# EAGLE design PT_2015_DB_MAIN_Rev1 (EAGLE 7.1.0)
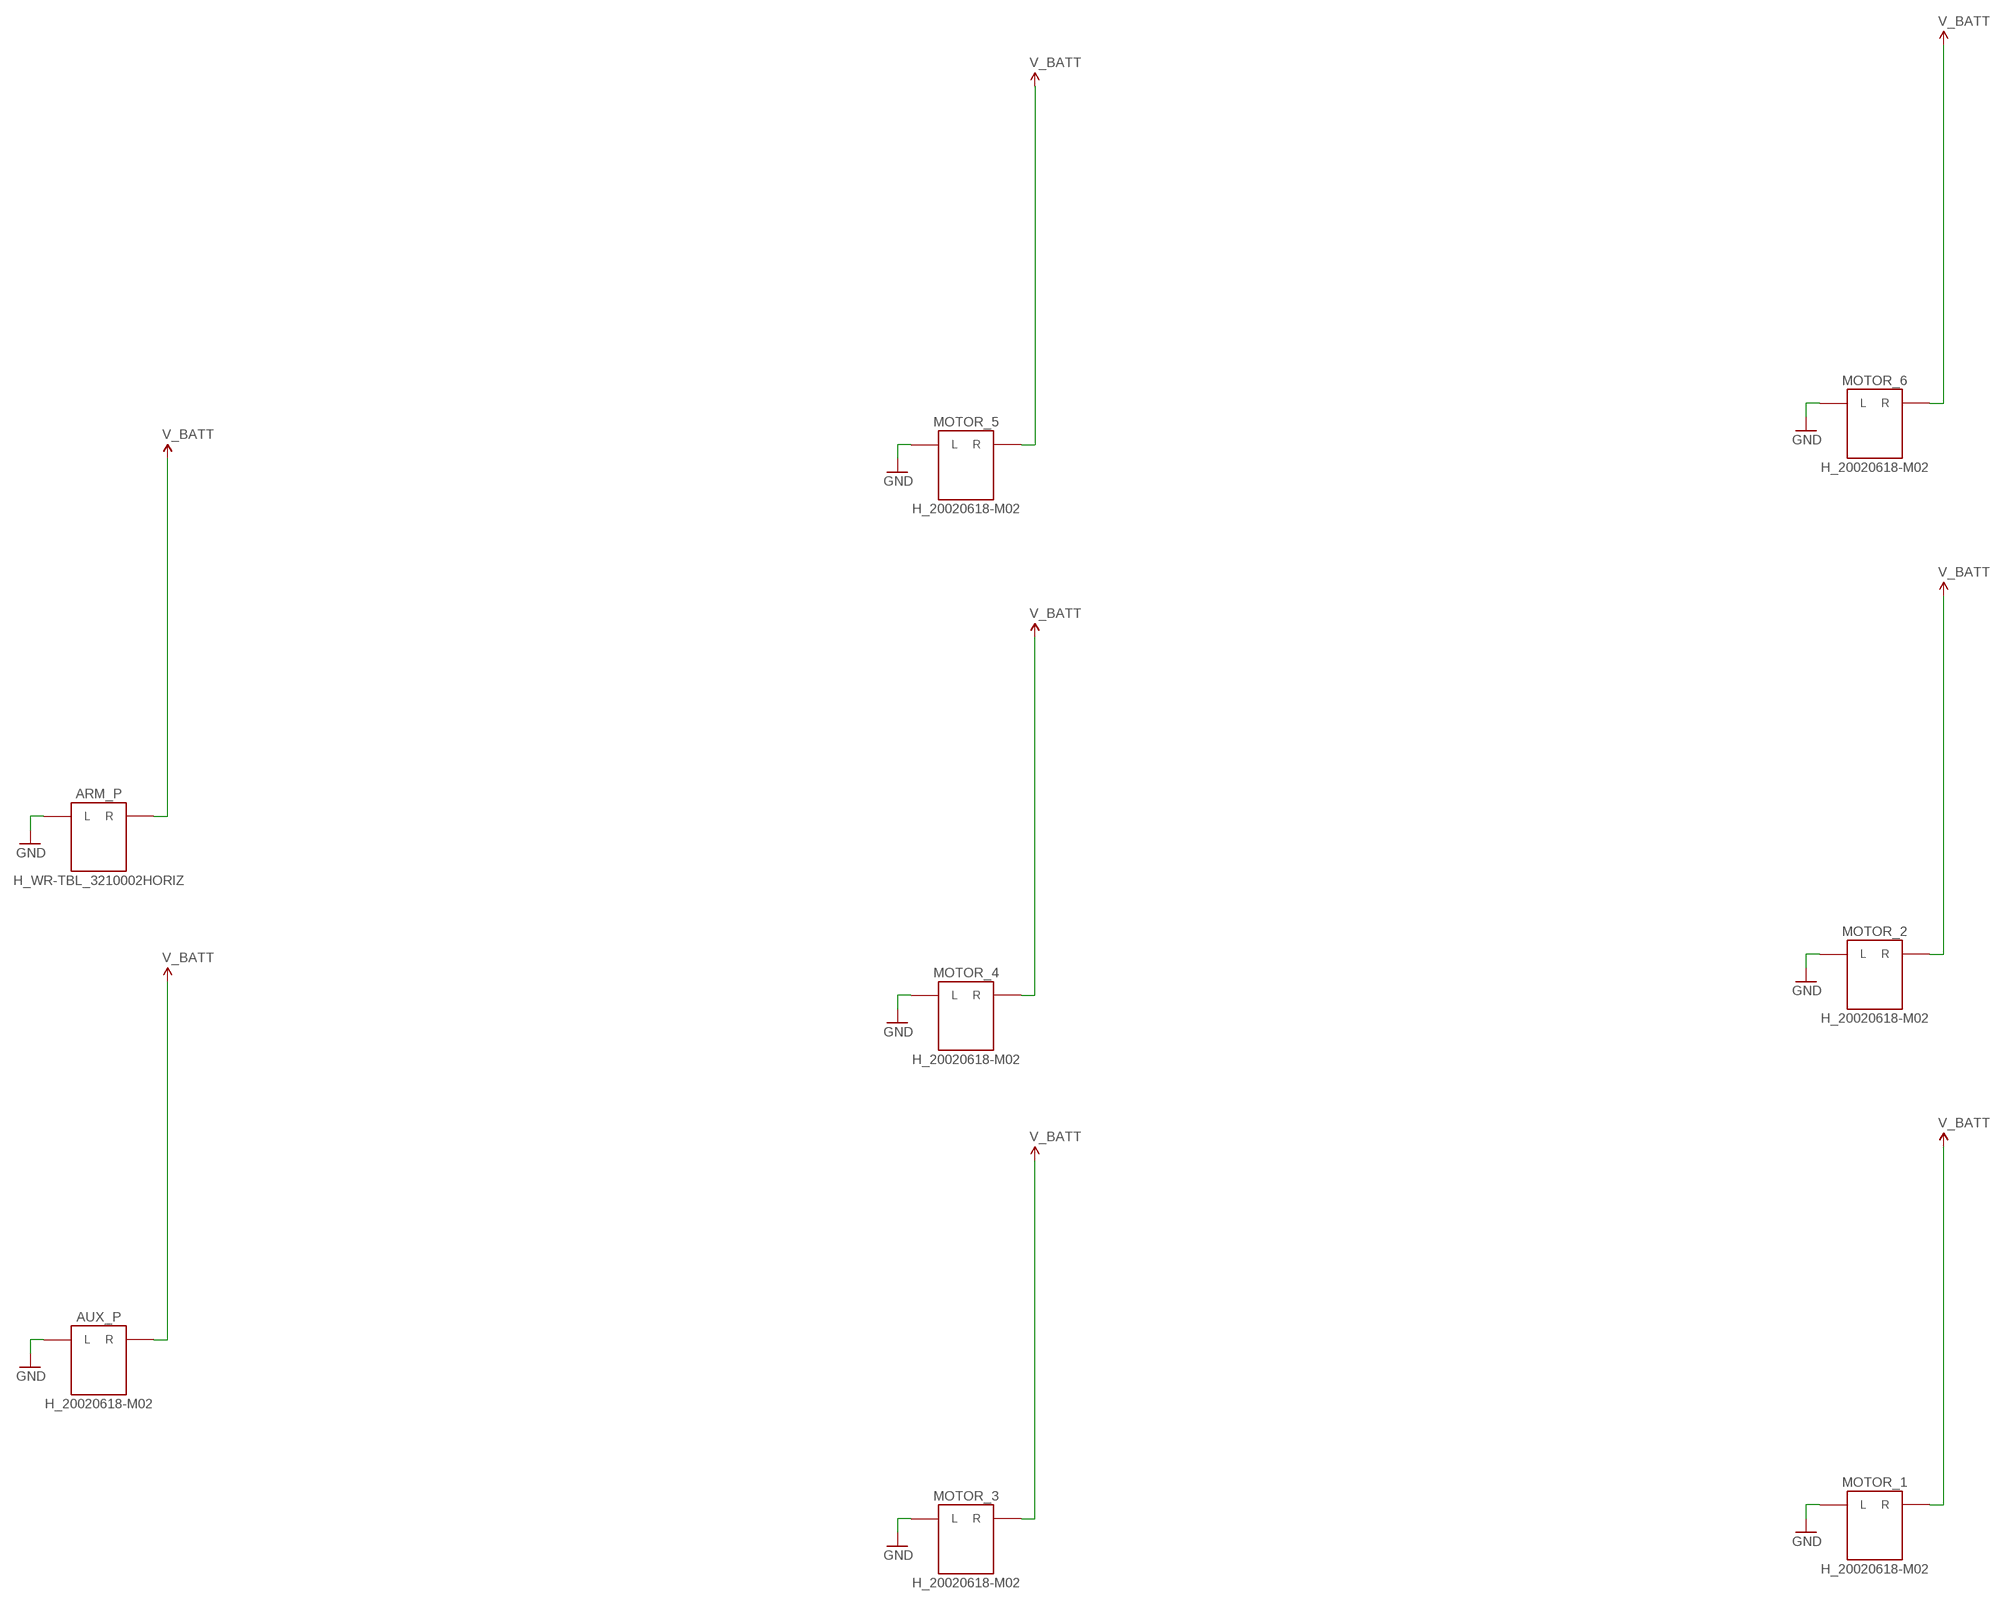
[diagram p0: schematic, sheet 1, part 1 of 2]
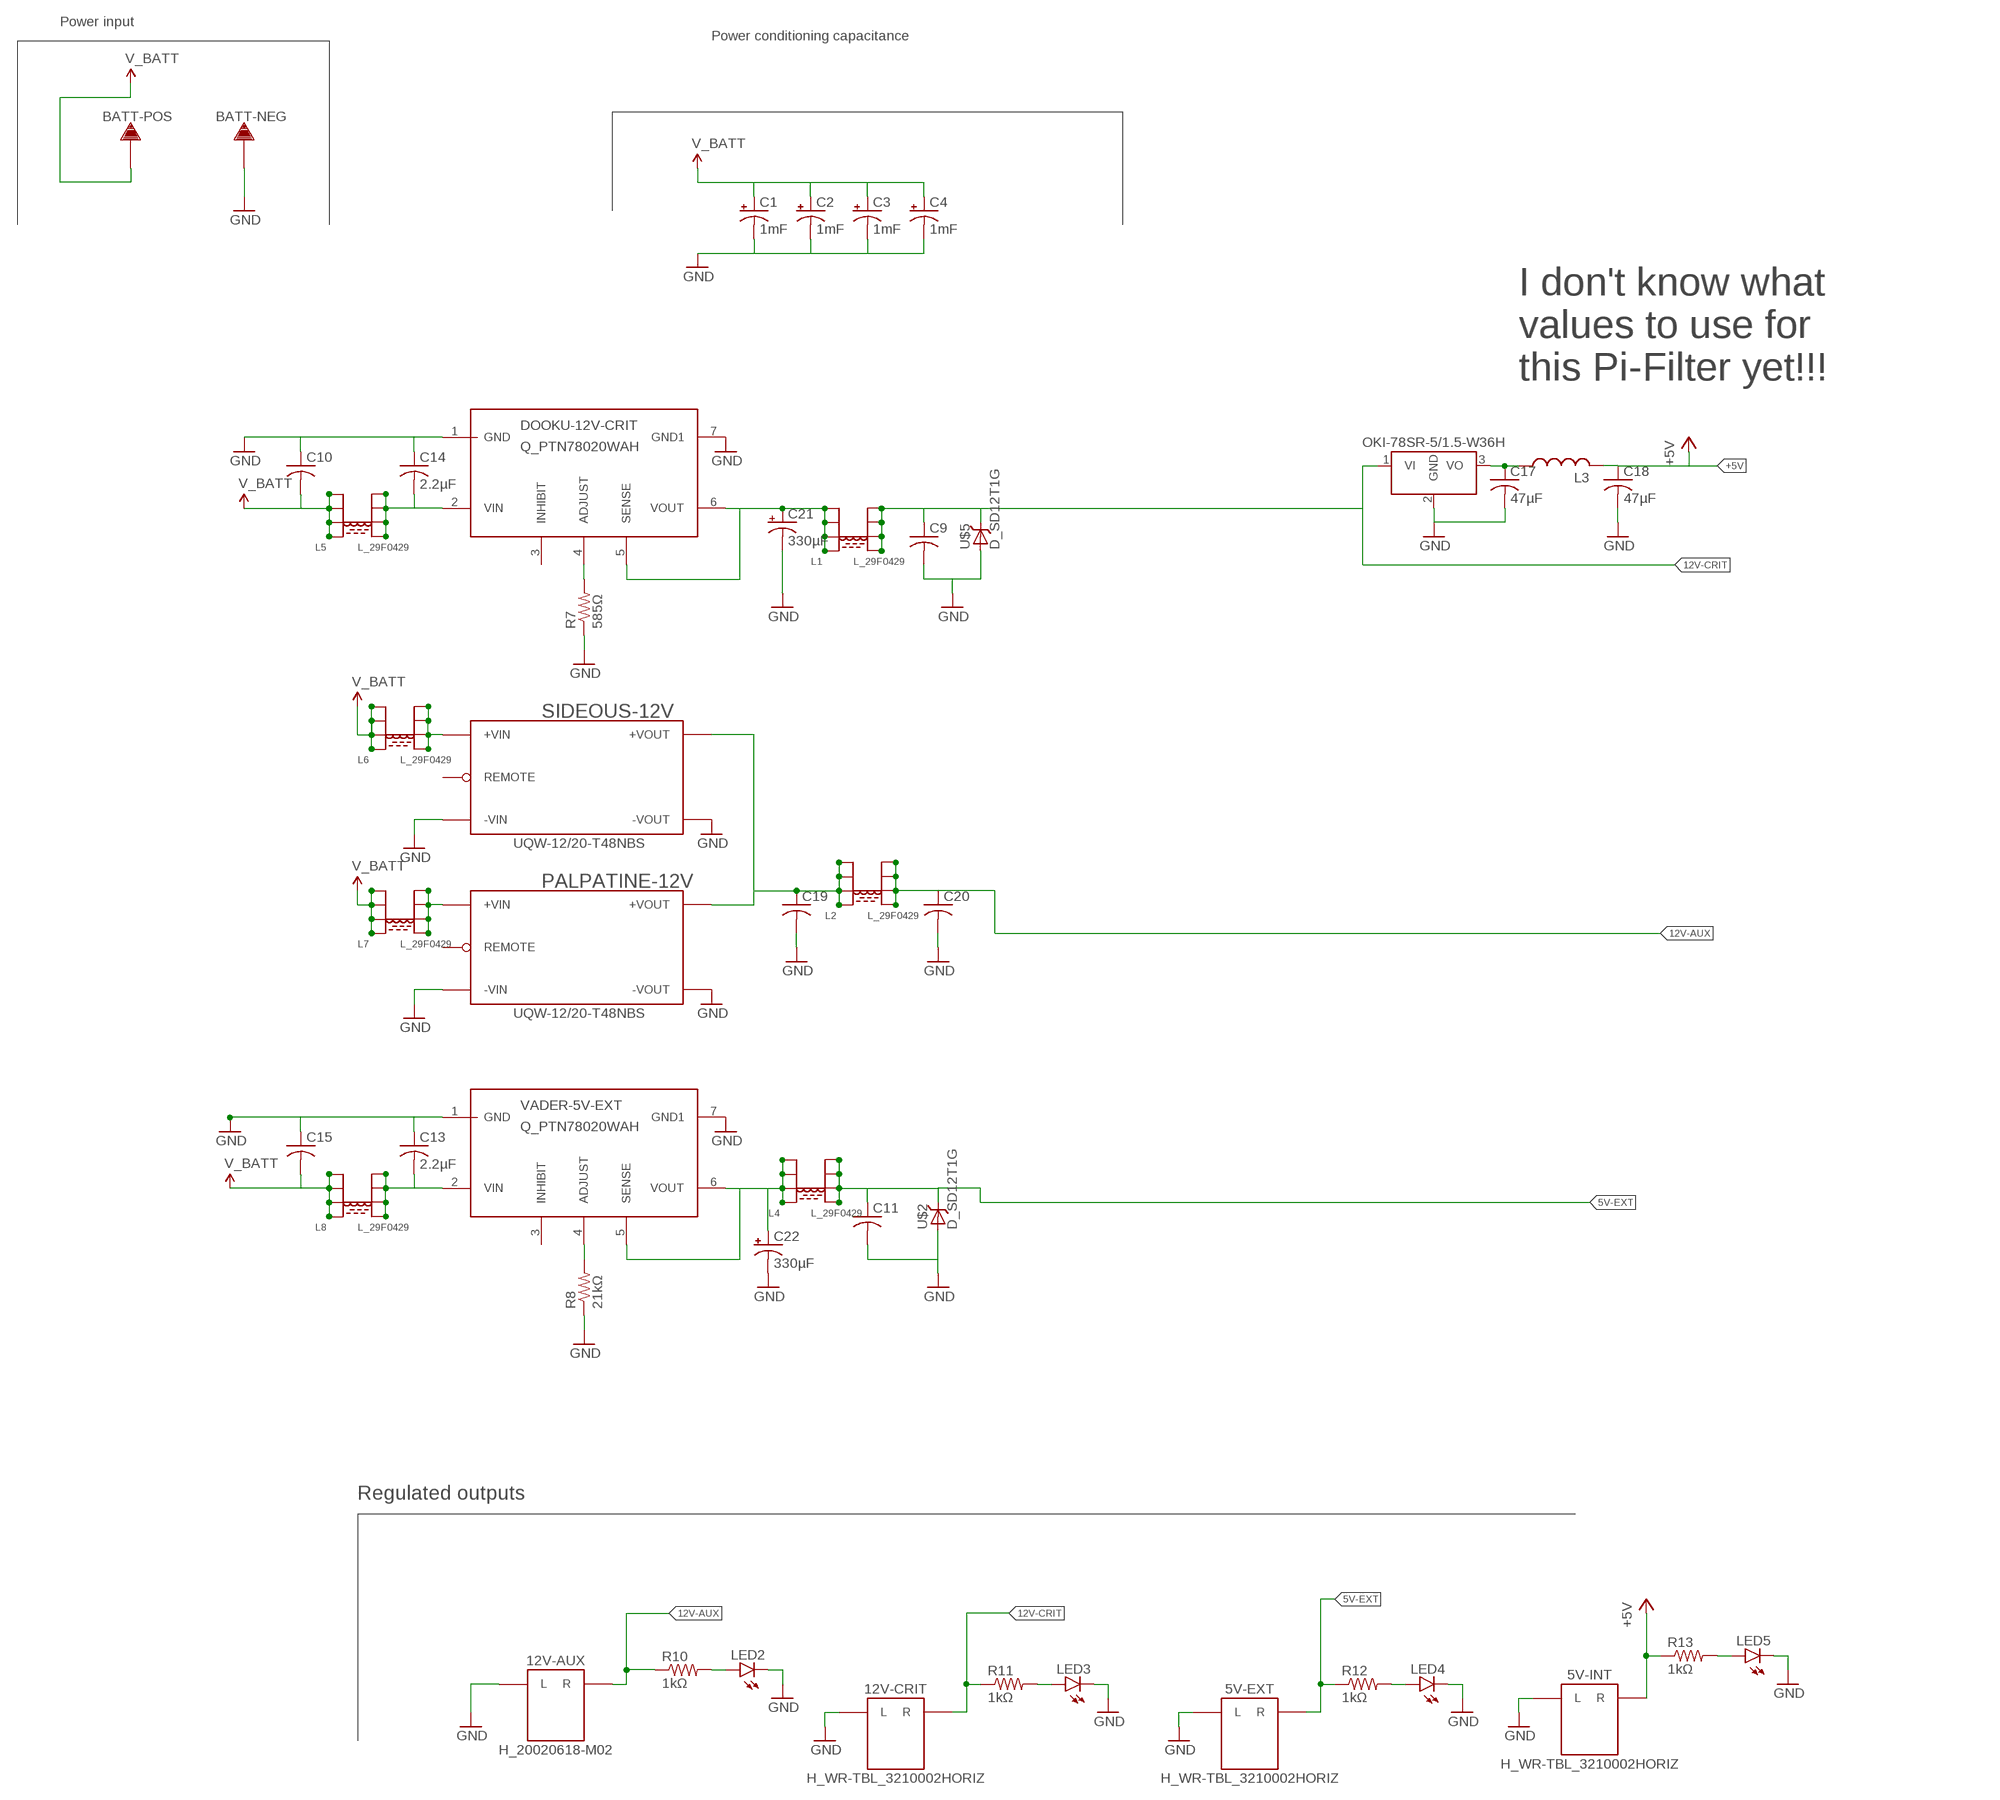
[diagram p1: schematic, sheet 1, part 2 of 2]

## Parts
5V-EXT  H_WR-TBL_3210002HORIZ  [691322110002]
5V-INT  H_WR-TBL_3210002HORIZ  [691322110002]
12V-AUX  H_20020618-M02  [20020618-M02]
12V-CRIT  H_WR-TBL_3210002HORIZ  [691322110002]
ARM_P  H_WR-TBL_3210002HORIZ  [691322110002]
AUX_P  H_20020618-M02  [20020618-M02]
BATT-NEG  TERMINAL_HOLE  [LARGE_TERMINAL_HOLE]
BATT-POS  TERMINAL_HOLE  [LARGE_TERMINAL_HOLE]
C1  1mF  C_POL12.5MM_NORMAL  [C_12.5MM]
C2  1mF  C_POL12.5MM_NORMAL  [C_12.5MM]
C3  1mF  C_POL12.5MM_NORMAL  [C_12.5MM]
C4  1mF  C_POL12.5MM_NORMAL  [C_12.5MM]
C9  C-USC1206  [C1206]
C10  C-USC1206  [C1206]
C11  C-USC1206  [C1206]
C13  2.2µF  C-USC1206  [C1206]
C14  2.2µF  C-USC1206  [C1206]
C15  C-USC1206  [C1206]
C17  47µF  C-USC1206  [C1206]
C18  47µF  C-USC1206  [C1206]
C19  C-USC1206  [C1206]
C20  C-USC1206  [C1206]
C21  330µF  CPOL-USE5-8.5  [E5-8,5]
C22  330µF  CPOL-USE5-8.5  [E5-8,5]
DOOKU-12V-CRIT  Q_PTN78020WAH  Q_PTN78020  [R_PDSS-T7]
L1  L_29F0429  [L_29F0429]
L2  L_29F0429  [L_29F0429]
L3  L-USL3216C  [L3216C]
L4  L_29F0429  [L_29F0429]
L5  L_29F0429  [L_29F0429]
L6  L_29F0429  [L_29F0429]
L7  L_29F0429  [L_29F0429]
L8  L_29F0429  [L_29F0429]
LED2  LED1206  [LED-1206]
LED3  LED1206  [LED-1206]
LED4  LED1206  [LED-1206]
LED5  LED1206  [LED-1206]
MOTOR_1  H_20020618-M02  [20020618-M02]
MOTOR_2  H_20020618-M02  [20020618-M02]
MOTOR_3  H_20020618-M02  [20020618-M02]
MOTOR_4  H_20020618-M02  [20020618-M02]
MOTOR_5  H_20020618-M02  [20020618-M02]
MOTOR_6  H_20020618-M02  [20020618-M02]
OKI-78SR-5/1.5-W36H  Q_OKI-78SR  [OKI-78SRH]
PALPATINE-12V  UQW-12/20-T48NBS  [U-T48-QB-NO_TRIM]
R7  585Ω  R-US_R1206  [R1206]
R8  21kΩ  R-US_R1206  [R1206]
R10  1kΩ  RESISTOR1206  [1206]
R11  1kΩ  RESISTOR1206  [1206]
R12  1kΩ  RESISTOR1206  [1206]
R13  1kΩ  RESISTOR1206  [1206]
SIDEOUS-12V  UQW-12/20-T48NBS  [U-T48-QB-NO_TRIM]
U$2  D_SD12T1G  [SOD-323]
U$5  D_SD12T1G  [SOD-323]
VADER-5V-EXT  Q_PTN78020WAH  Q_PTN78020  [R_PDSS-T7]

## Nets
5V-EXT: 5V-EXT.R C11.1 L4.5 L4.6 L4.7 L4.8 R12.1 U$2.1(C)
12V-AUX: 12V-AUX.R1(R) 12V-AUX.R2(R) C20.1 L2.5 L2.6 L2.7 L2.8 R10.1
12V-CRIT: 12V-CRIT.R C9.1 L1.5 L1.6 L1.7 L1.8 OKI-78SR-5/1.5-W36H.1(VI) R11.1 U$5.1(C)
+5V: 5V-INT.R C18.1 L3.2 R13.1
GND: 5V-EXT.L 5V-INT.L 12V-AUX.L1(L) 12V-AUX.L2(L) 12V-CRIT.L ARM_P.L AUX_P.L1(L) AUX_P.L2(L) BATT-NEG.P$1 C1.- C2.- C3.- C4.- C9.2 C10.1 C11.2 C13.1 C14.1 C15.1 C17.2 C18.2 C19.2 C20.2 C21.- C22.- DOOKU-12V-CRIT.1(GND) DOOKU-12V-CRIT.7(GND1) LED2.C LED3.C LED4.C LED5.C MOTOR_1.L1(L) MOTOR_1.L2(L) MOTOR_2.L1(L) MOTOR_2.L2(L) MOTOR_3.L1(L) MOTOR_3.L2(L) MOTOR_4.L1(L) MOTOR_4.L2(L) MOTOR_5.L1(L) MOTOR_5.L2(L) MOTOR_6.L1(L) MOTOR_6.L2(L) OKI-78SR-5/1.5-W36H.2(GND) PALPATINE-12V.3(-VIN) PALPATINE-12V.4(-VOUT) R7.1 R8.1 SIDEOUS-12V.3(-VIN) SIDEOUS-12V.4(-VOUT) U$2.2(A) U$5.2(A) VADER-5V-EXT.1(GND) VADER-5V-EXT.7(GND1)
N$3: C13.2 L8.5 L8.6 L8.7 L8.8 VADER-5V-EXT.2(VIN)
N$5: L7.5 L7.6 L7.7 L7.8 PALPATINE-12V.1(+VIN)
N$6: L6.5 L6.6 L6.7 L6.8 SIDEOUS-12V.1(+VIN)
N$7: C19.1 L2.1 L2.2 L2.3 L2.4 PALPATINE-12V.8(+VOUT) SIDEOUS-12V.8(+VOUT)
N$8: C14.2 DOOKU-12V-CRIT.2(VIN) L5.5 L5.6 L5.7 L5.8
N$9: DOOKU-12V-CRIT.4(ADJUST) R7.2
N$15: C22.+ L4.1 L4.2 L4.3 L4.4 VADER-5V-EXT.5(SENSE) VADER-5V-EXT.6(VOUT)
N$35: R8.2 VADER-5V-EXT.4(ADJUST)
N$36: C21.+ DOOKU-12V-CRIT.5(SENSE) DOOKU-12V-CRIT.6(VOUT) L1.1 L1.2 L1.3 L1.4
N$46: LED2.A R10.2
N$48: LED3.A R11.2
N$50: LED4.A R12.2
N$52: LED5.A R13.2
N$100: C17.1 L3.1 OKI-78SR-5/1.5-W36H.3(VO)
V_BATT: ARM_P.R AUX_P.R1(R) AUX_P.R2(R) BATT-POS.P$1 C1.+ C2.+ C3.+ C4.+ C10.2 C15.2 L5.1 L5.2 L5.3 L5.4 L6.1 L6.2 L6.3 L6.4 L7.1 L7.2 L7.3 L7.4 L8.1 L8.2 L8.3 L8.4 MOTOR_1.R1(R) MOTOR_1.R2(R) MOTOR_2.R1(R) MOTOR_2.R2(R) MOTOR_3.R1(R) MOTOR_3.R2(R) MOTOR_4.R1(R) MOTOR_4.R2(R) MOTOR_5.R1(R) MOTOR_5.R2(R) MOTOR_6.R1(R) MOTOR_6.R2(R)
Unconnected: DOOKU-12V-CRIT.3(INHIBIT) PALPATINE-12V.2(REMOTE) SIDEOUS-12V.2(REMOTE) VADER-5V-EXT.3(INHIBIT)

## Notes on the sheet
- Power input
- Power conditioning capacitance
- I don't know what
  values to use for
  this Pi-Filter yet!!!
- Regulated outputs

## Library data of the parts
5V-EXT 5V-INT 12V-CRIT ARM_P = MRDT-2015-PowerBoard:H_WR-TBL_32*1*0002: Wurth Electronic's 2-pin 10A pluggable screw terminal headers. Vertical and Horizantal Part Numbers: 691322110002 (Horizantal) 691321100002 (Vertical); DIGIKEY_PN: 732-2769-ND
12V-AUX AUX_P MOTOR_1-MOTOR_6 = MRDT-2015-PowerBoard:H_20020618-M02*: 20020618-M02* header pin from FCI. Rated up to 32A
BATT-NEG BATT-POS = MRDT-2015-PowerBoard:TERMINAL_HOLE
C1-C4 = MRDT-2014-All:C_POL: Alum Elect. Cap with 10mm diameter, 5mm lead spacing and 0.7mm lead diameter
C9-C11 C13-C15 C17-C20 = resistor:C-US: CAPACITOR, American symbol
C21 C22 = resistor:CPOL-US: POLARIZED CAPACITOR, American symbol
DOOKU-12V-CRIT VADER-5V-EXT = MRDT-2015-PowerBoard:Q_PTN78020: TI DC/DC converter 36Vin - Adjustable output
L1 L2 L4-L8 = MRDT-2014-All:L_29F0429: Through-Hole Ferrite Bead 285 Ohm @ 100MHz
L3 = resistor:L-US: INDUCTOR, American symbol
LED2-LED5 = SparkFun-LED:LED: LEDs Standard schematic elements and footprints for 5mm, 3mm, 1206, and 0603 sized LEDs. 5mm - Spark Fun Electronics SKU : COM-00529 (and others)
OKI-78SR-5/1.5-W36H = MRDT-2015-PowerBoard:Q_OKI-78SR: 4.95W DC/DC Converter Manufacturer: Murata Part Number: OKI-78SR-5/1.5-W36H-C OKI-78SR-3.3/1.5-W36H-C
PALPATINE-12V SIDEOUS-12V = MRDT-2015-PowerBoard:UQW-12/20-T48NBS
R7 R8 = resistor:R-US_: RESISTOR, American symbol
R10-R13 = SparkFun-Passives:RESISTOR: Resistor Basic schematic elements and footprints for 0603, 1206, and PTH resistors.
U$2 U$5 = MRDT-2014-All:D_SD12T1G: 12V or 5V Zener

## Board
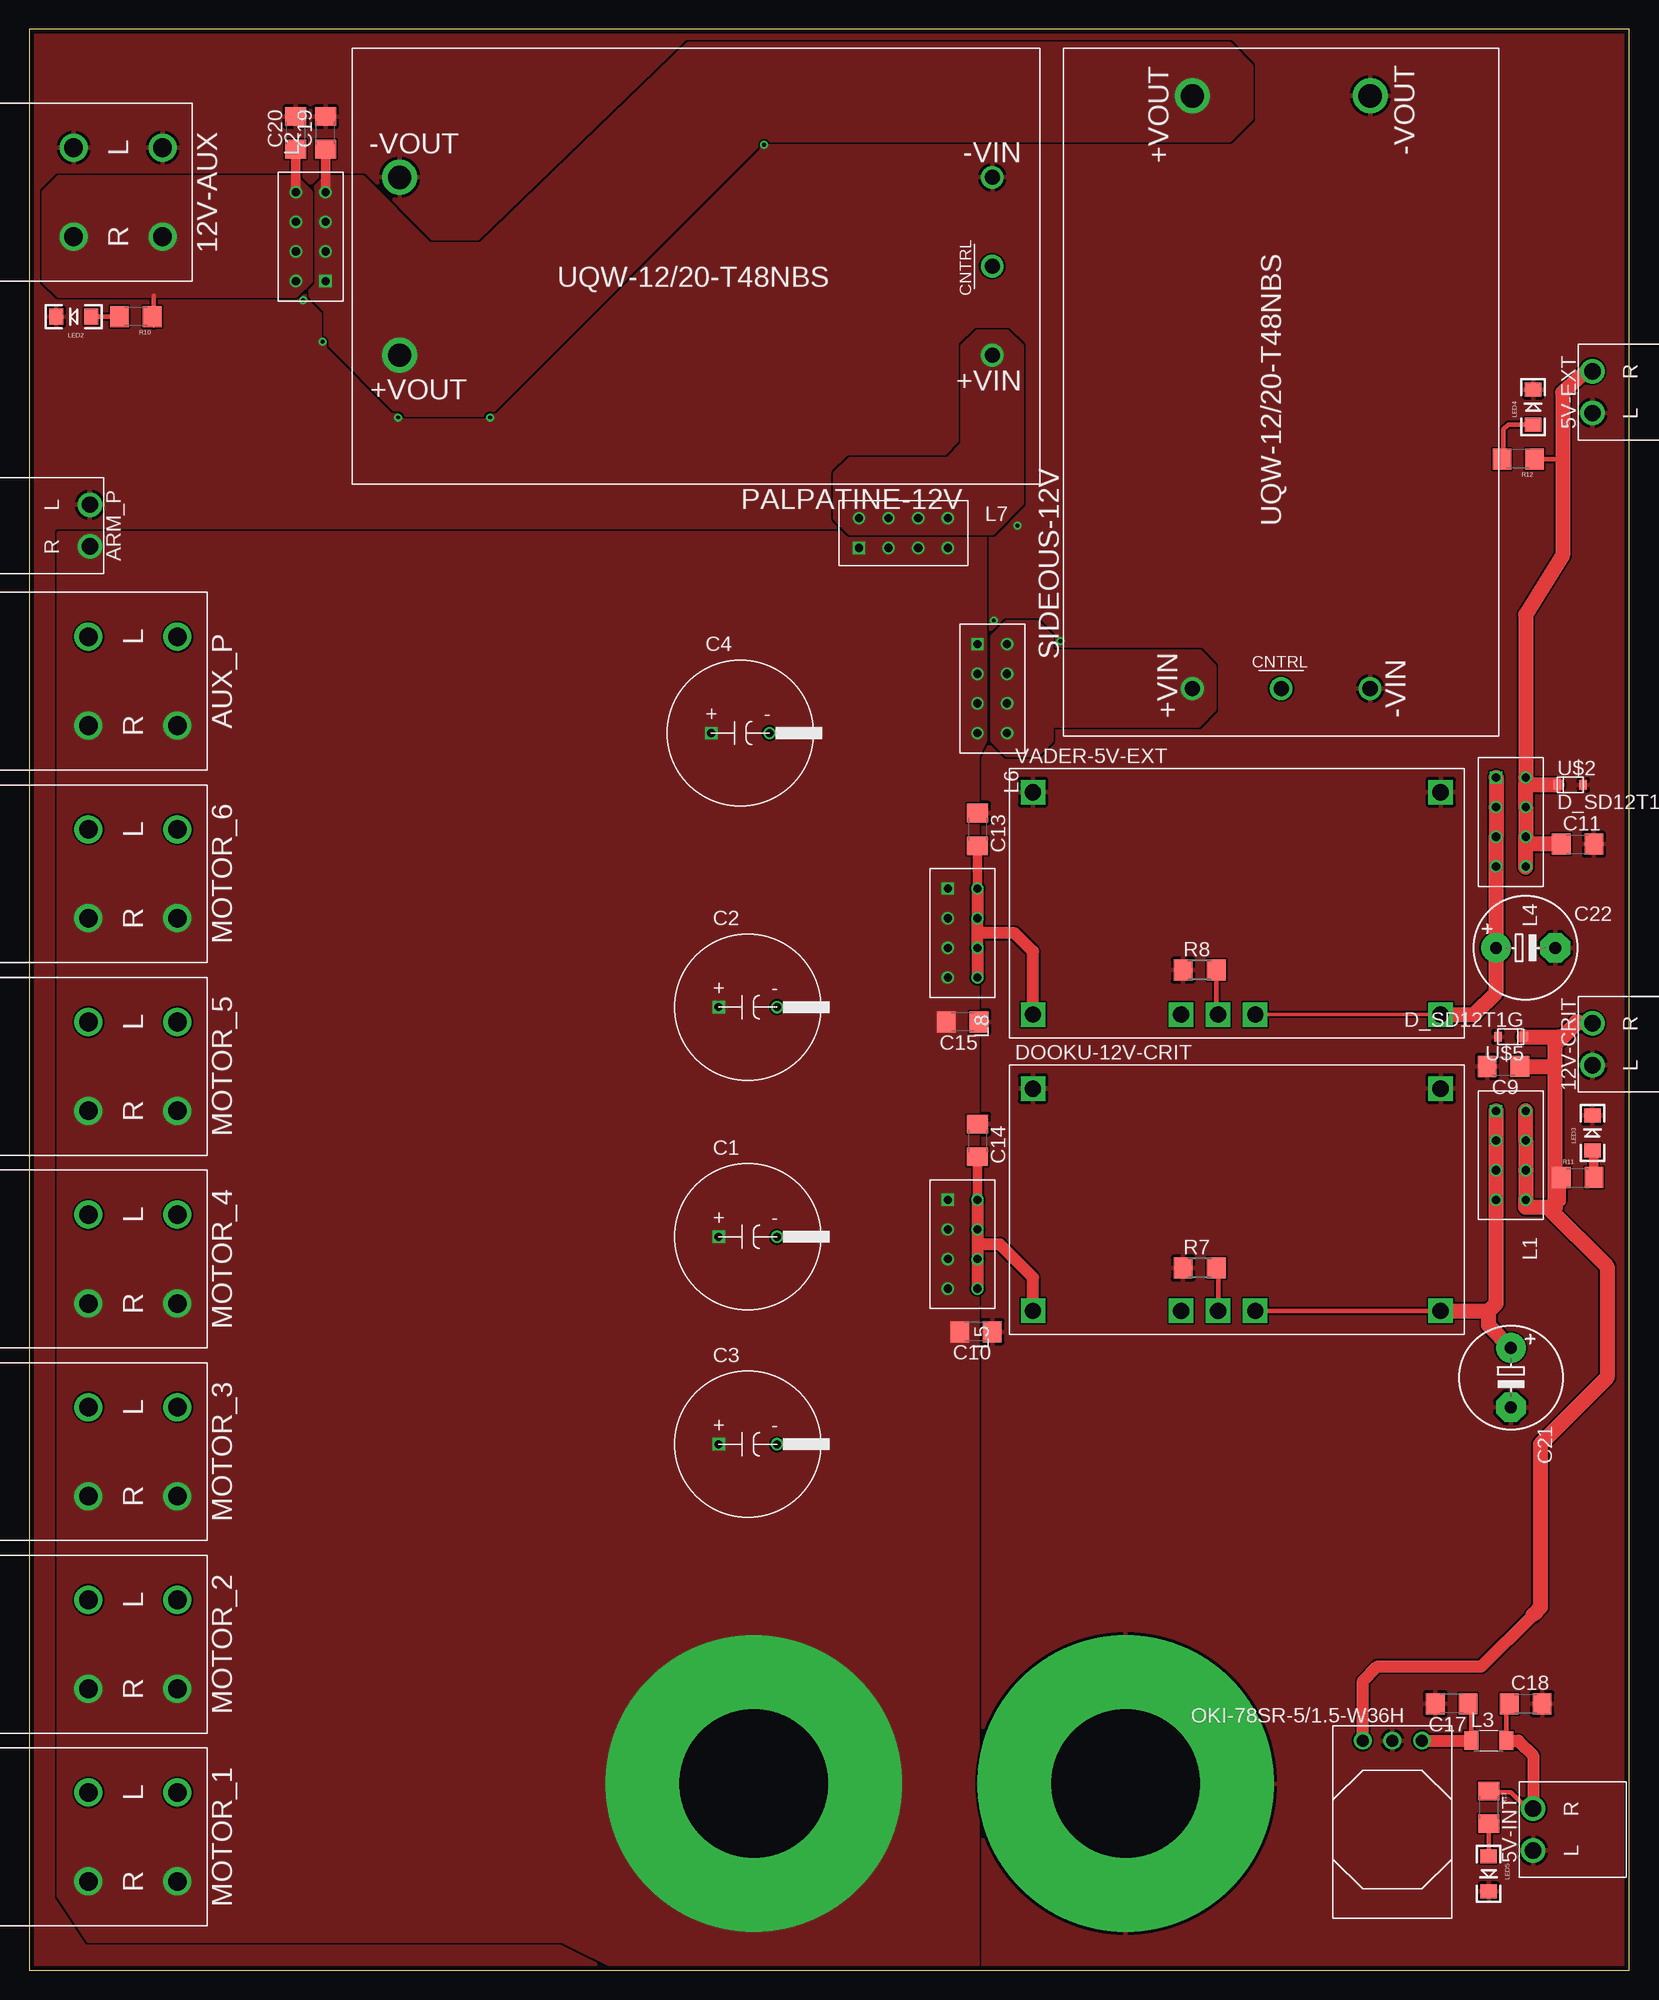
[diagram p2: board, top side]
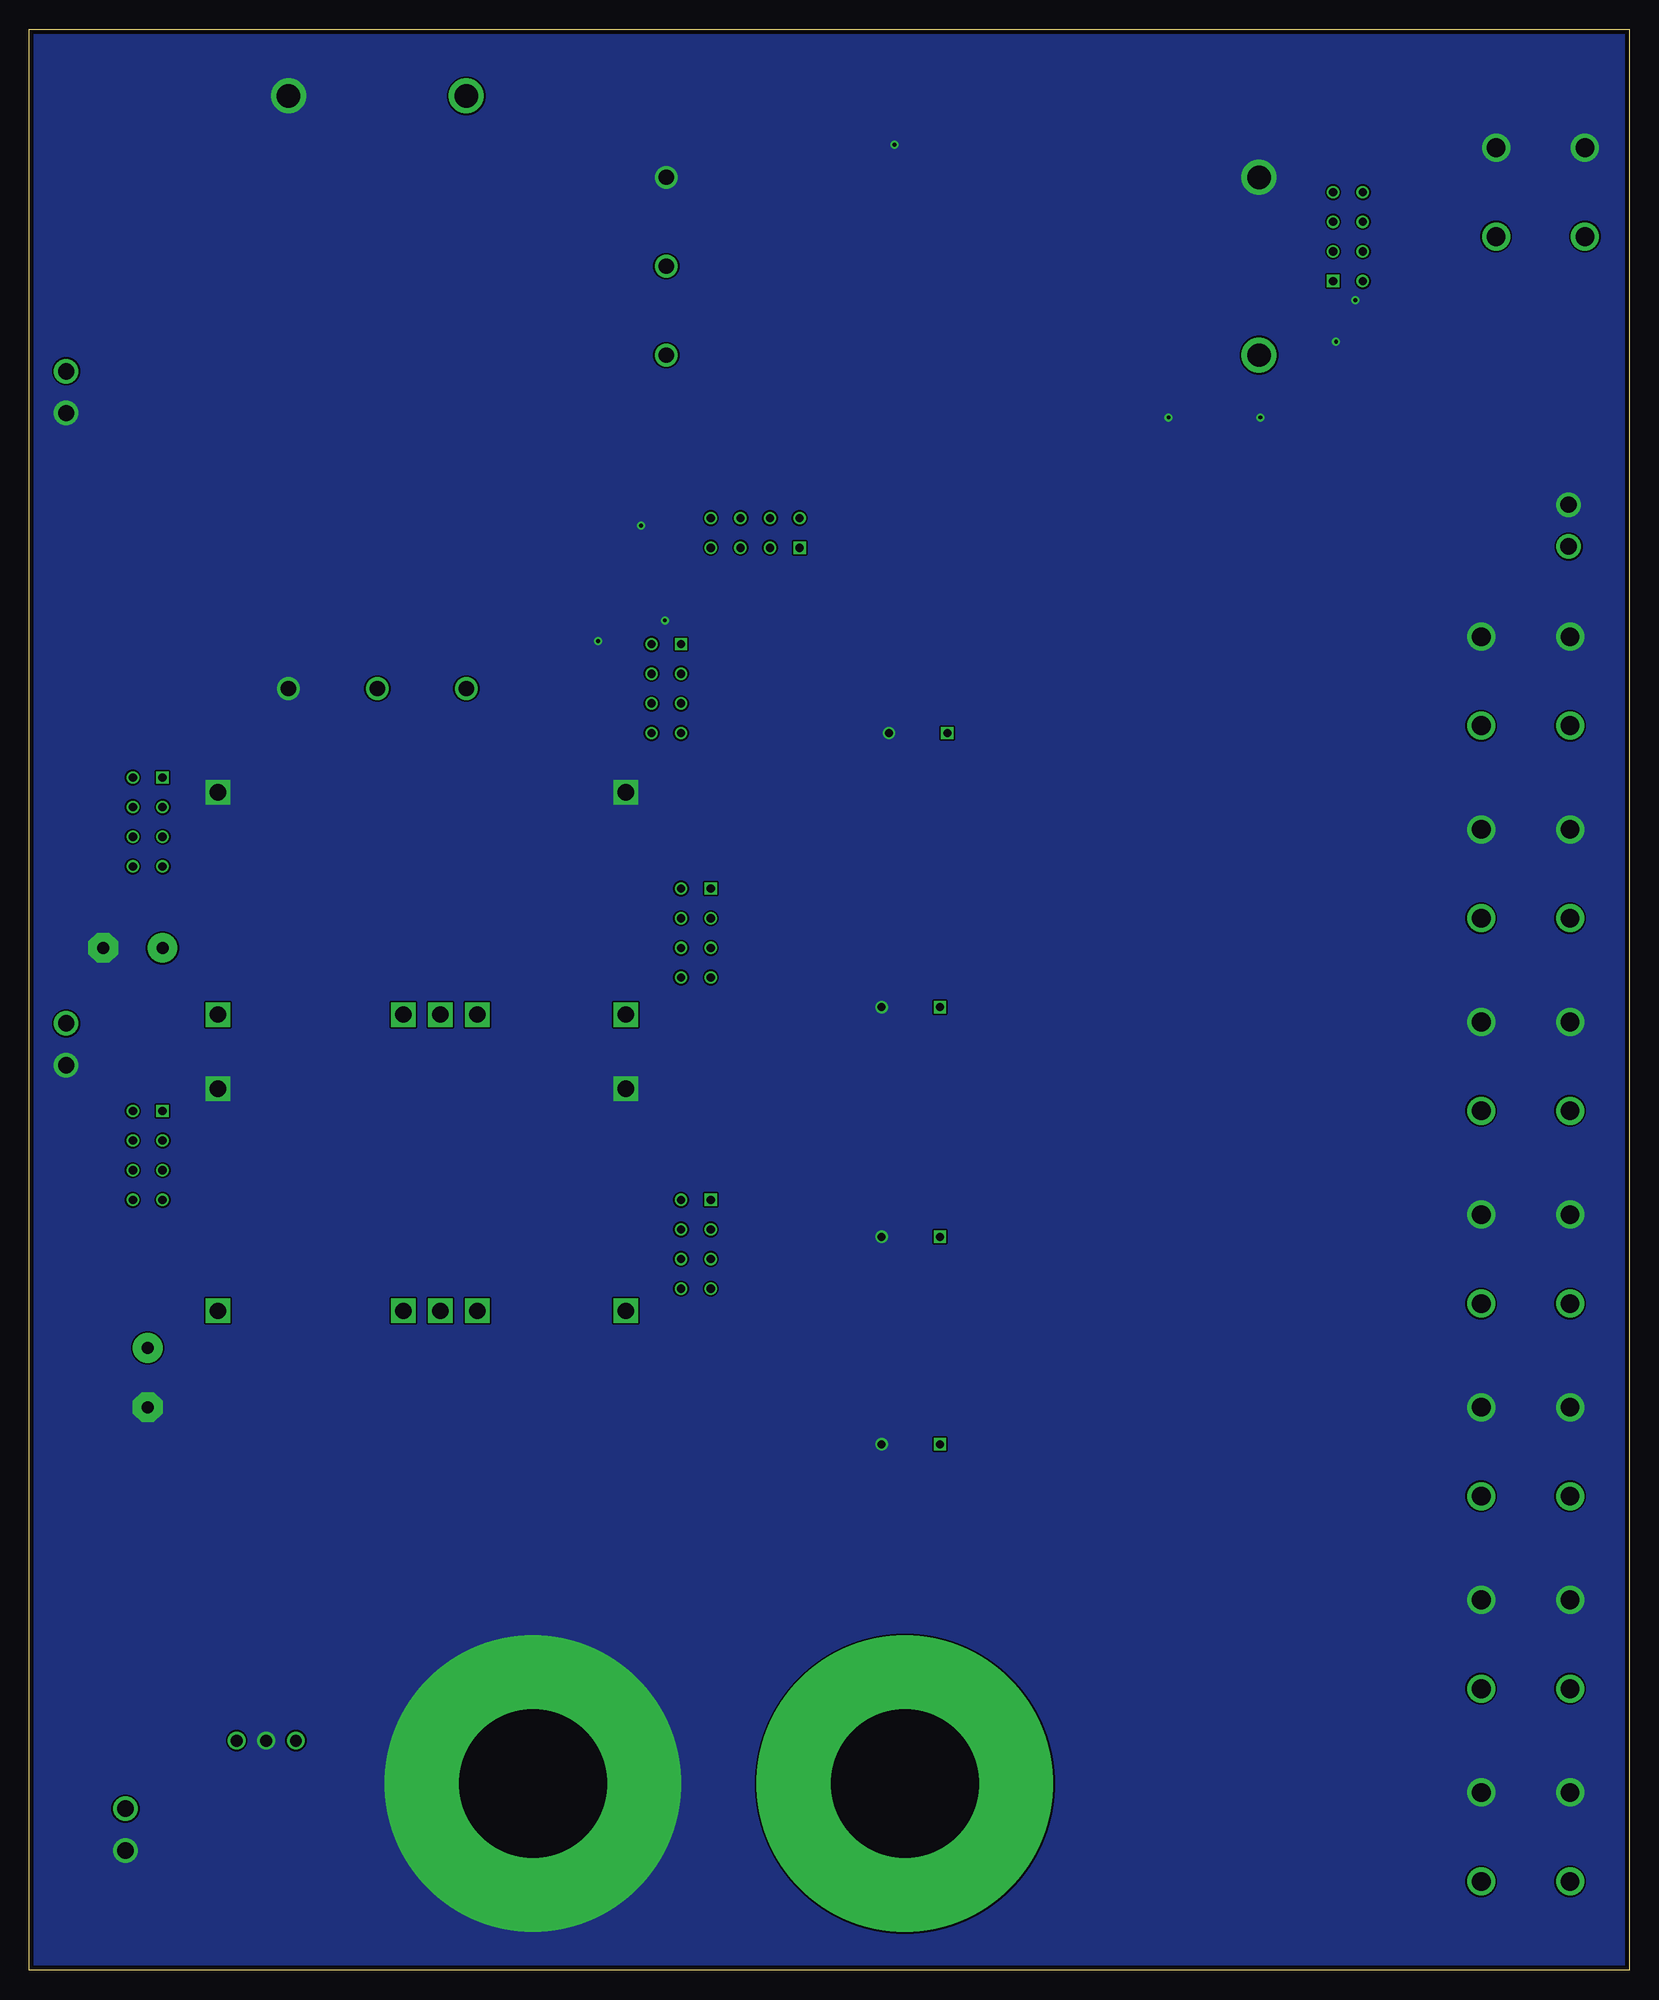
[diagram p3: board, bottom side, seen from below]

Size 137.16 x 166.37 mm. Coordinates in mm from the lower left corner, seen from the top.
Outline: 0,0 137.16,0 137.16,166.37 0,166.37 0,0
Copper layers (1*16): Top 0.0356mm / dielectric 1.5011mm / Bottom 0.0356mm
Design rules "OSHPark": minimum track width 6mil, minimum drill 13mil, track to track 6mil, track to pad 6mil, pad to pad 6mil, via to via 6mil, smd to smd 6mil, copper to edge 15mil, drill to drill 6mil, minimum pad ring 7mil, minimum via ring 7mil, stop-mask expansion 3mil, vias tented up to drill 0mil, thermal gap 10mil

### Footprints (pad centres in the part's own frame; a part is rotated, then mirrored left to right if it is on the bottom)
691322110002 = drill 1.4: L -1.79,0; R 1.79,0
20020618-M02 = drill 1.6: L1 -3.81,3.81; L2 -3.81,-3.81; R1 3.81,3.81; R2 3.81,-3.81
LARGE_TERMINAL_HOLE = drill 12.7 pad 25.4: P$1 0,0
C_12.5MM = drill 0.7 square: + -2.5,0 | drill 0.7: - 2.5,0
C1206 = smd 1.6 x 1.8: 1 -1.4,0; 2 1.4,0
E5-8,5 = drill 1.016 pad 2.54: + -2.54,0 | drill 1.016 pad 2.54 octagon: - 2.54,0
R_PDSS-T7 = drill 1.4 square: 1 -17.47,9.53; 2 -17.47,-9.52; 3 -4.77,-9.52; 4 -1.59,-9.52; 5 1.59,-9.52; 6 17.47,-9.52; 7 17.47,9.53
L_29F0429 = drill 0.7 square: 1 -3.81,-1.27 | drill 0.7: 2 -1.27,-1.27; 3 1.27,-1.27; 4 3.81,-1.27; 5 3.81,1.27; 6 1.27,1.27; 7 -1.27,1.27; 8 -3.81,1.27
L3216C = smd 1.2 x 1.6: 1 -1.5,0; 2 1.5,0
LED-1206 = smd 1.2 x 1.4: A -1.5,0; C 1.5,0
OKI-78SRH = drill 1.016: 1 2.54,0; 2 0,0; 3 -2.54,0
U-T48-QB-NO_TRIM = drill 1.3: 1 -25.4,7.62; 2 -25.4,0; 3 -25.4,-7.62 | drill 2: 4 25.4,-7.62; 8 25.4,7.62
R1206 = smd 1.6 x 1.803: 1 -1.422,0; 2 1.422,0
1206 = smd 1.6 x 1.8: 1 -1.4,0; 2 1.4,0
SOD-323 = smd 0.63 x 0.83: 1 -1.115,0; 2 1.115,0

### Placement (x,y rotation side)
5V-EXT  H_WR-TBL_321*0002HORIZ  [691322110002]  133.99,135.25 90 top
5V-INT  H_WR-TBL_321*0002HORIZ  [691322110002]  128.91,12.07 90 top
12V-AUX  7.62,152.4 270 top
12V-CRIT  H_WR-TBL_321*0002HORIZ  [691322110002]  133.99,79.38 90 top
ARM_P  H_WR-TBL_321*0002HORIZ  [691322110002]  5.21,123.83 270 top
AUX_P  8.89,110.49 270 top
BATT-NEG  93.98,16 0 top
BATT-POS  62.1,16 0 top
C1  61.59,62.87 0 top
C2  61.59,82.55 0 top
C3  61.59,45.09 0 top
C4  60.96,106.05 0 top
C9  126.36,77.47 180 top
C10  81.15,54.74 180 top
C11  132.72,96.52 0 top
C13  81.28,97.79 270 top
C14  81.28,71.12 270 top
C15  80.01,81.28 180 top
C17  121.92,22.86 180 top
C18  128.27,22.86 0 top
C19  25.4,157.48 90 top
C20  22.86,157.48 90 top
C21  127,50.8 270 top
C22  128.27,87.63 0 top
DOOKU-12V-CRIT  103.5,66.04 0 top
L1  127,69.85 270 top
L2  24.13,148.59 90 top
L3  125.09,19.68 0 top
L4  127,98.43 270 top
L5  80.01,62.23 270 top
L6  82.55,109.86 270 top
L7  74.93,123.19 0 top
L8  80.01,88.9 270 top
LED2  3.81,141.73 180 top
LED3  133.99,71.76 90 top
LED4  128.91,133.98 90 top
LED5  125.09,8.25 270 top
MOTOR_1  8.89,11.43 270 top
MOTOR_2  8.89,27.94 270 top
MOTOR_3  8.89,44.45 270 top
MOTOR_4  8.89,60.96 270 top
MOTOR_5  8.89,77.47 270 top
MOTOR_6  8.89,93.98 270 top
OKI-78SR-5/1.5-W36H  116.84,19.68 180 top
PALPATINE-12V  57.15,146.05 180 top
R7  100.33,60.2 0 top
R8  100.33,85.73 0 top
R10  9.14,141.73 180 top
R11  132.72,67.95 0 top
R12  127.64,129.54 180 top
R13  125.09,13.97 270 top
SIDEOUS-12V  107.31,135.25 90 top
U$2  132.08,101.6 0 top
U$5  127,80.01 180 top
VADER-5V-EXT  103.5,91.44 0 top

### Tracks (layer width: path | path; a pad name or v marks a point on that pad's centre or on a via)
5V-EXT
  Top 0.406: R12.1 131.44,129.54
  Top 1.27: 5V-EXT.R 133.47,137.04 131.44,135.25 131.44,129.54 131.44,121.29 128.27,116.21 L4.8 128.27,101.6 | 128.27,94.56 L4.5 128.27,96.52 | 128.27,96.52 L4.6 L4.7 128.27,101.6 | C11.1 128.27,96.52 | U$2.1 128.27,101.6
12V-AUX
  Top 0.406: R10.1 10.67,140.97 10.67,143.51
  Top 0.813: C20.1 L2.5
  pour Top (rank 2, no thermals): 2.54,153.67 22.86,153.67 24.13,152.4 24.13,144.78 22.86,143.51 2.54,143.51 1.27,144.78 1.27,152.4
12V-CRIT
  Top 0.813: R11.1 131.31,65.91 130.81,65.41
  Top 1.016: OKI-78SR-5/1.5-W36H.1 114.3,24.77 115.57,26.04 124.46,26.04 128.91,30.48
  Top 1.27: 130.81,77.47 130.81,65.41 130.18,65.41 | 130.81,77.47 130.81,79.38 131.13,79.69 | 131.13,79.69 132.72,81.28 132.6,81.28 12V-CRIT.R | 128.91,30.48 129.54,31.11 129.54,45.09 135.25,50.8 135.25,60.32 130.18,65.41 | U$5.1 131.13,80.01 131.13,79.69 | C9.1 130.81,77.47 | 130.18,65.41 128.27,65.41 L1.5 L1.6 L1.7 L1.8
+5V
  Top 0.406: L3.2 126.59,22.59 C18.1 | 5V-INT.R 128.38,13.86 127,15.24 125.22,15.24 R13.1
  Top 1.016: L3.2 127.64,19.68 128.91,18.41 5V-INT.R
GND  (via drill 0.33)
  other vias: 23.5,143.13 25.15,139.57 31.62,133.1 39.5,133.1 62.99,156.46 82.68,115.7 88.39,113.92 84.71,123.83
  pour Bottom (no thermals): -1.27,-3.81 153.67,-3.81 153.67,173.99 -1.27,173.99
  pour Top (rank 4): -2.54,-5.08 151.13,-5.08 151.13,176.53 -2.54,176.53
N$3
  Top 0.813: L8.8 C13.2
  Top 1.016: L8.8 L8.7 81.28,88.9 | L8.5 L8.6 81.28,88.9 | VADER-5V-EXT.2 86.03,87.32 84.45,88.9 81.28,88.9
N$5
  pour Top (no thermals): 70.36,123.19 82.55,123.19 85.09,125.73 85.09,139.19 83.82,140.46 81.28,140.46 80.01,139.19 80.01,130.81 78.74,129.54 70.36,129.54 69.09,128.27 69.09,124.46
N$6
  pour Top (no thermals): 83.82,115.57 82.55,114.3 82.55,105.41 83.82,104.14 86.36,104.14 87.63,105.41 87.63,106.68 100.2,106.68 101.6,108.08 101.6,111.76 100.33,113.03 87.63,113.03 87.63,114.3 86.36,115.57
N$7
  Top 0.813: L2.4 C19.1
  pour Top (rank 3, no thermals): 31.75,133.35 39.37,133.35 62.87,156.84 102.87,156.84 104.78,158.75 104.78,163.19 102.87,165.1 56.52,165.1 38.73,147.95 34.29,147.95 28.57,153.67 25.4,153.67 24.13,152.4 24.13,143.51 25.4,142.24 25.4,139.7
N$8
  Top 0.813: C14.2 L5.8
  Top 1.016: L5.8 L5.7 81.28,62.23 | 81.28,62.23 L5.6 L5.5 | DOOKU-12V-CRIT.2 86.03,59.38 83.19,62.23 81.28,62.23
N$9
  Top 0.406: DOOKU-12V-CRIT.4 101.92,59.53 R7.2
N$15
  Top 0.305: VADER-5V-EXT.6 VADER-5V-EXT.5
  Top 1.27: VADER-5V-EXT.6 123.83,81.92 125.73,83.82 C22.+ L4.4 L4.3 L4.2 L4.1
N$35
  Top 0.406: R8.2 101.75,82.08 VADER-5V-EXT.4
N$36
  Top 0.406: DOOKU-12V-CRIT.5 DOOKU-12V-CRIT.6
  Top 1.27: DOOKU-12V-CRIT.6 125.1,56.52 | 125.1,56.52 125.73,57.15 L1.4 L1.3 L1.2 L1.1 | C21.+ 125.09,55.26 125.1,56.52
N$46
  Top 0.406: LED2.A R10.2
N$48
  Top 0.813: R11.2 134.12,70.12 LED3.A
N$50
  Top 0.406: LED4.A 126.77,132.48 126.36,132.08 126.36,129.67 R12.2
N$52
  Top 0.406: R13.2 LED5.A
N$100
  Top 0.406: L3.1 123.59,22.59 C17.1
  Top 1.016: OKI-78SR-5/1.5-W36H.3 L3.1
V_BATT
  pour Top (rank 2, no thermals): 2.54,123.19 2.54,6.35 5.08,2.54 45.72,2.54 51.05,-0.13 81.28,0 81.28,104.14 81.92,105.41 81.92,123.19

### Text on the board
tStop: Jake Armenta / Missouri MRDT / Powerboard 2015